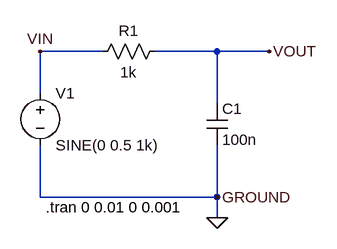
[diagram p0: schematic R1C1.asc]
R1C1.asc, the LTspice schematic file:
Version 4
SHEET 1 880 680
WIRE 112 -288 16 -288
WIRE 288 -288 192 -288
WIRE 368 -288 288 -288
WIRE 16 -224 16 -288
WIRE 288 -208 288 -288
WIRE 16 -64 16 -144
WIRE 288 -64 288 -144
WIRE 288 -64 16 -64
WIRE 288 -32 288 -64
FLAG 368 -288 VOUT
FLAG 288 -32 0
FLAG 288 -64 GROUND
FLAG 16 -288 VIN
SYMBOL res 96 -272 R270
WINDOW 0 32 56 VTop 2
WINDOW 3 0 56 VBottom 2
SYMATTR InstName R1
SYMATTR Value 1k
SYMBOL cap 272 -208 R0
SYMATTR InstName C1
SYMATTR Value 100n
SYMBOL voltage 16 -240 R0
WINDOW 123 0 0 Left 0
WINDOW 39 0 0 Left 0
SYMATTR InstName V1
SYMATTR Value SINE(0 0.5 1k)
TEXT 24 -48 Left 2 !.tran 0 0.01 0 0.001

The netlist it stands for:
* R1C1.asc
R1 VIN VOUT 1k
C1 VOUT 0 100n
V1 VIN 0 SINE(0 0.5 1k)
.tran 0 0.01 0 0.001
.backanno
.end